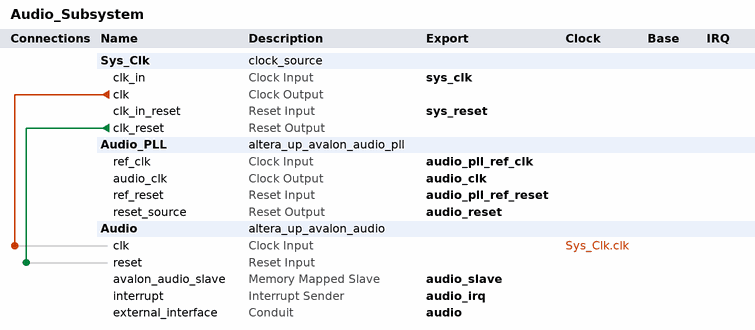
[diagram p0: system contents]
# Platform Designer (Qsys) system Audio_Subsystem, Cyclone V 5CSEMA5F31C6
# Parameters at their usual value, and those the tool derives, are not listed.
package require -exact qsys 18.0
create_system Audio_Subsystem
set_project_property DEVICE_FAMILY {Cyclone V}
set_project_property DEVICE 5CSEMA5F31C6

add_instance Sys_Clk clock_source 18.1
set_instance_parameter_value Sys_Clk clockFrequency 50000000
set_instance_parameter_value Sys_Clk clockFrequencyKnown false

add_instance Audio_PLL altera_up_avalon_audio_pll 18.0
set_instance_parameter_value Audio_PLL gui_refclk 50.0

add_instance Audio altera_up_avalon_audio 18.0
set_instance_parameter_value Audio audio_in true
set_instance_parameter_value Audio avalon_bus_type {Memory Mapped}
set_instance_parameter_value Audio dw 32

# connections
add_connection Sys_Clk.clk Audio.clk clock
add_connection Sys_Clk.clk_reset Audio.reset reset

# exported interfaces
add_interface audio conduit end
set_interface_property audio EXPORT_OF Audio.external_interface
add_interface audio_clk clock source
set_interface_property audio_clk EXPORT_OF Audio_PLL.audio_clk
add_interface audio_irq interrupt sender
set_interface_property audio_irq EXPORT_OF Audio.interrupt
add_interface audio_pll_ref_clk clock sink
set_interface_property audio_pll_ref_clk EXPORT_OF Audio_PLL.ref_clk
add_interface audio_pll_ref_reset reset sink
set_interface_property audio_pll_ref_reset EXPORT_OF Audio_PLL.ref_reset
add_interface audio_reset reset source
set_interface_property audio_reset EXPORT_OF Audio_PLL.reset_source
add_interface audio_slave avalon slave
set_interface_property audio_slave EXPORT_OF Audio.avalon_audio_slave
add_interface sys_clk clock sink
set_interface_property sys_clk EXPORT_OF Sys_Clk.clk_in
add_interface sys_reset reset sink
set_interface_property sys_reset EXPORT_OF Sys_Clk.clk_in_reset

set_interconnect_requirement {$system} qsys_mm.clockCrossingAdapter HANDSHAKE
set_interconnect_requirement {$system} qsys_mm.enableEccProtection FALSE
set_interconnect_requirement {$system} qsys_mm.insertDefaultSlave FALSE
set_interconnect_requirement {$system} qsys_mm.maxAdditionalLatency 1

save_system Audio_Subsystem.qsys
